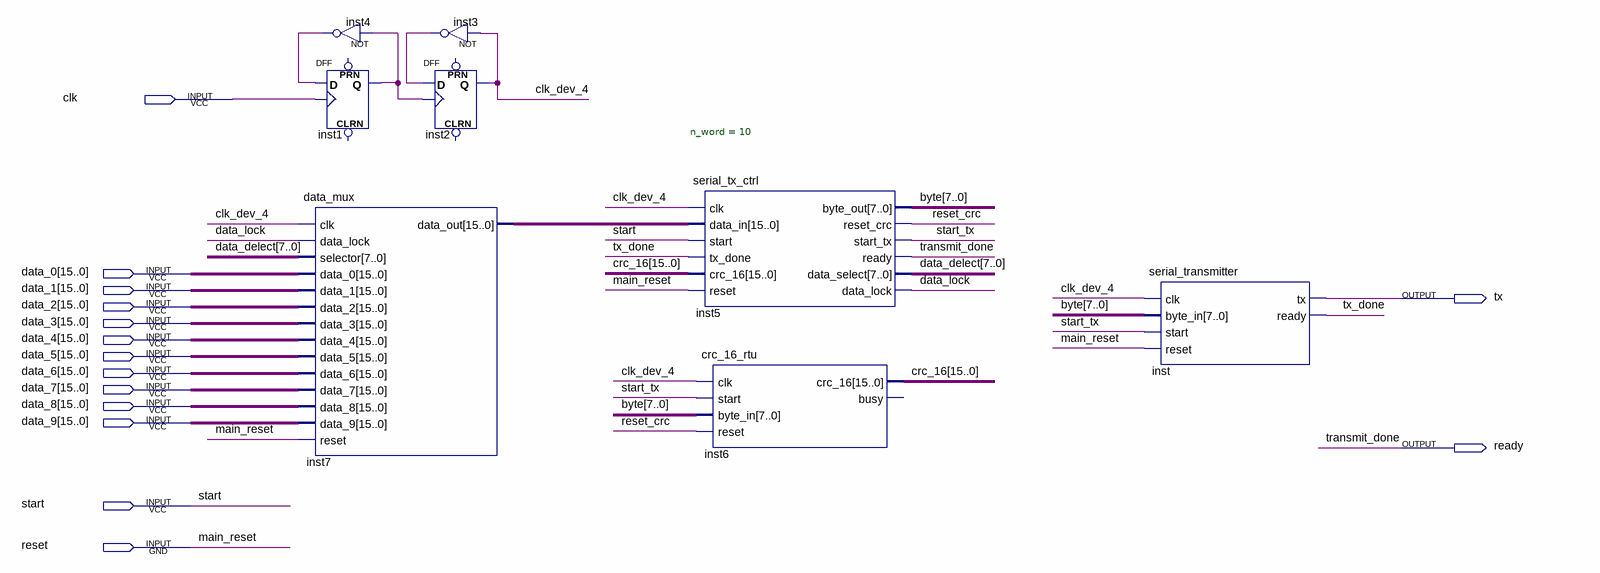
[diagram p0: schematic sheet]
// Quartus schematic serial_transmitter_main_10_words.bdf as structural Verilog: 8 symbols, 15 pins
module serial_transmitter_main_10_words (
  input  clk,
  input  [15:0] data_0,
  input  [15:0] data_1,
  input  [15:0] data_2,
  input  [15:0] data_3,
  input  [15:0] data_4,
  input  [15:0] data_5,
  input  [15:0] data_6,
  input  [15:0] data_7,
  input  [15:0] data_8,
  input  [15:0] data_9,
  input  start,
  input  reset,
  output tx,
  output ready
);

  wire clk_dev_4, data_lock, inst1_q, inst3_out, inst4_out, reset_crc, start_tx, tx_done;
  wire [7:0] \byte , data_delect;
  wire [15:0] crc_16, inst7_data_out;

  data_mux inst7 (
    .clk(clk_dev_4), .data_lock(data_lock), .selector(data_delect), .data_0(data_0), .data_1(data_1),
    .data_2(data_2), .data_3(data_3), .data_4(data_4), .data_5(data_5), .data_6(data_6), .data_7(data_7),
    .data_8(data_8), .data_9(data_9), .reset(reset), .data_out(inst7_data_out));
  not inst4 (inst4_out, inst1_q);
  DFF inst1 (.CLK(clk), .D(inst4_out), .Q(inst1_q));  // open: CLRN, PRN
  not inst3 (inst3_out, clk_dev_4);
  DFF inst2 (.CLK(inst1_q), .D(inst3_out), .Q(clk_dev_4));  // open: CLRN, PRN
  serial_tx_ctrl #(.n_word(10)) inst5 (
    .clk(clk_dev_4), .data_in(inst7_data_out), .start(start), .tx_done(tx_done), .crc_16(crc_16),
    .reset(reset), .byte_out(\byte ), .reset_crc(reset_crc), .start_tx(start_tx), .ready(ready),
    .data_select(data_delect), .data_lock(data_lock));
  crc_16_rtu inst6 (
    .clk(clk_dev_4), .start(start_tx), .byte_in(\byte ), .reset(reset_crc), .crc_16(crc_16));  // open: busy
  serial_transmitter inst (
    .clk(clk_dev_4), .byte_in(\byte ), .start(start_tx), .reset(reset), .tx(tx), .ready(tx_done));

  // Other names for the same wires on the sheet: main_reset = reset; transmit_done = ready
endmodule
